# Altium schematic sheet LCD_FSM.SchDoc
size A4
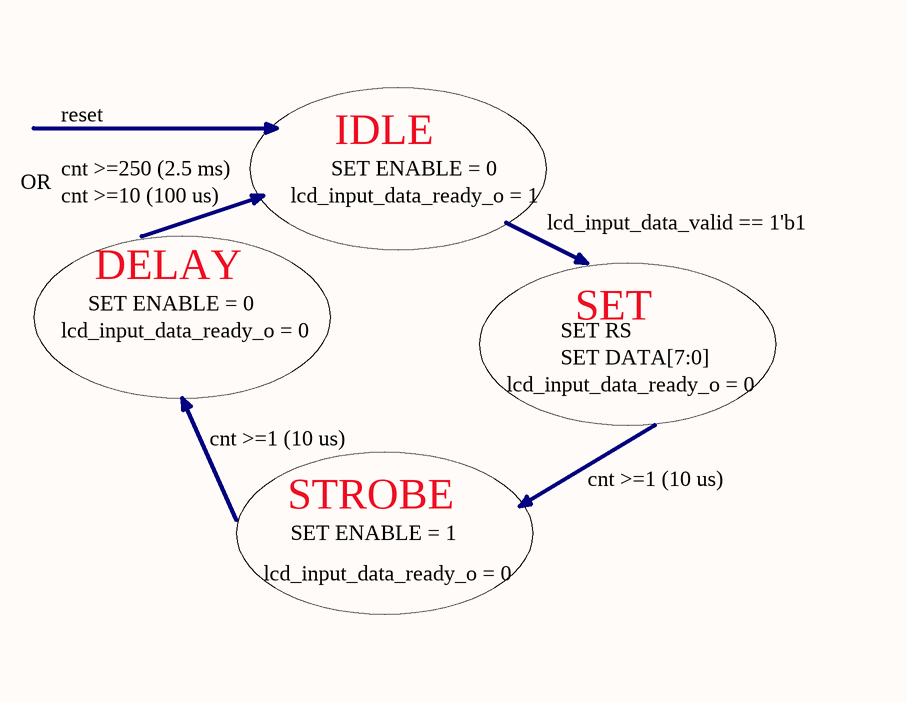
[diagram p0: LCD_FSM.SchDoc]

## Notes on the sheet
- reset
- cnt >=250 (2.5 ms)
- SET ENABLE = 0
- IDLE
- OR
- cnt >=10 (100 us)
- lcd_input_data_ready_o = 1
- lcd_input_data_valid == 1'b1
- DELAY
- lcd_input_data_ready_o = 0
- SET RS
- SET DATA[7:0]
- SET
- cnt >=1 (10 us)
- STROBE
- SET ENABLE = 1